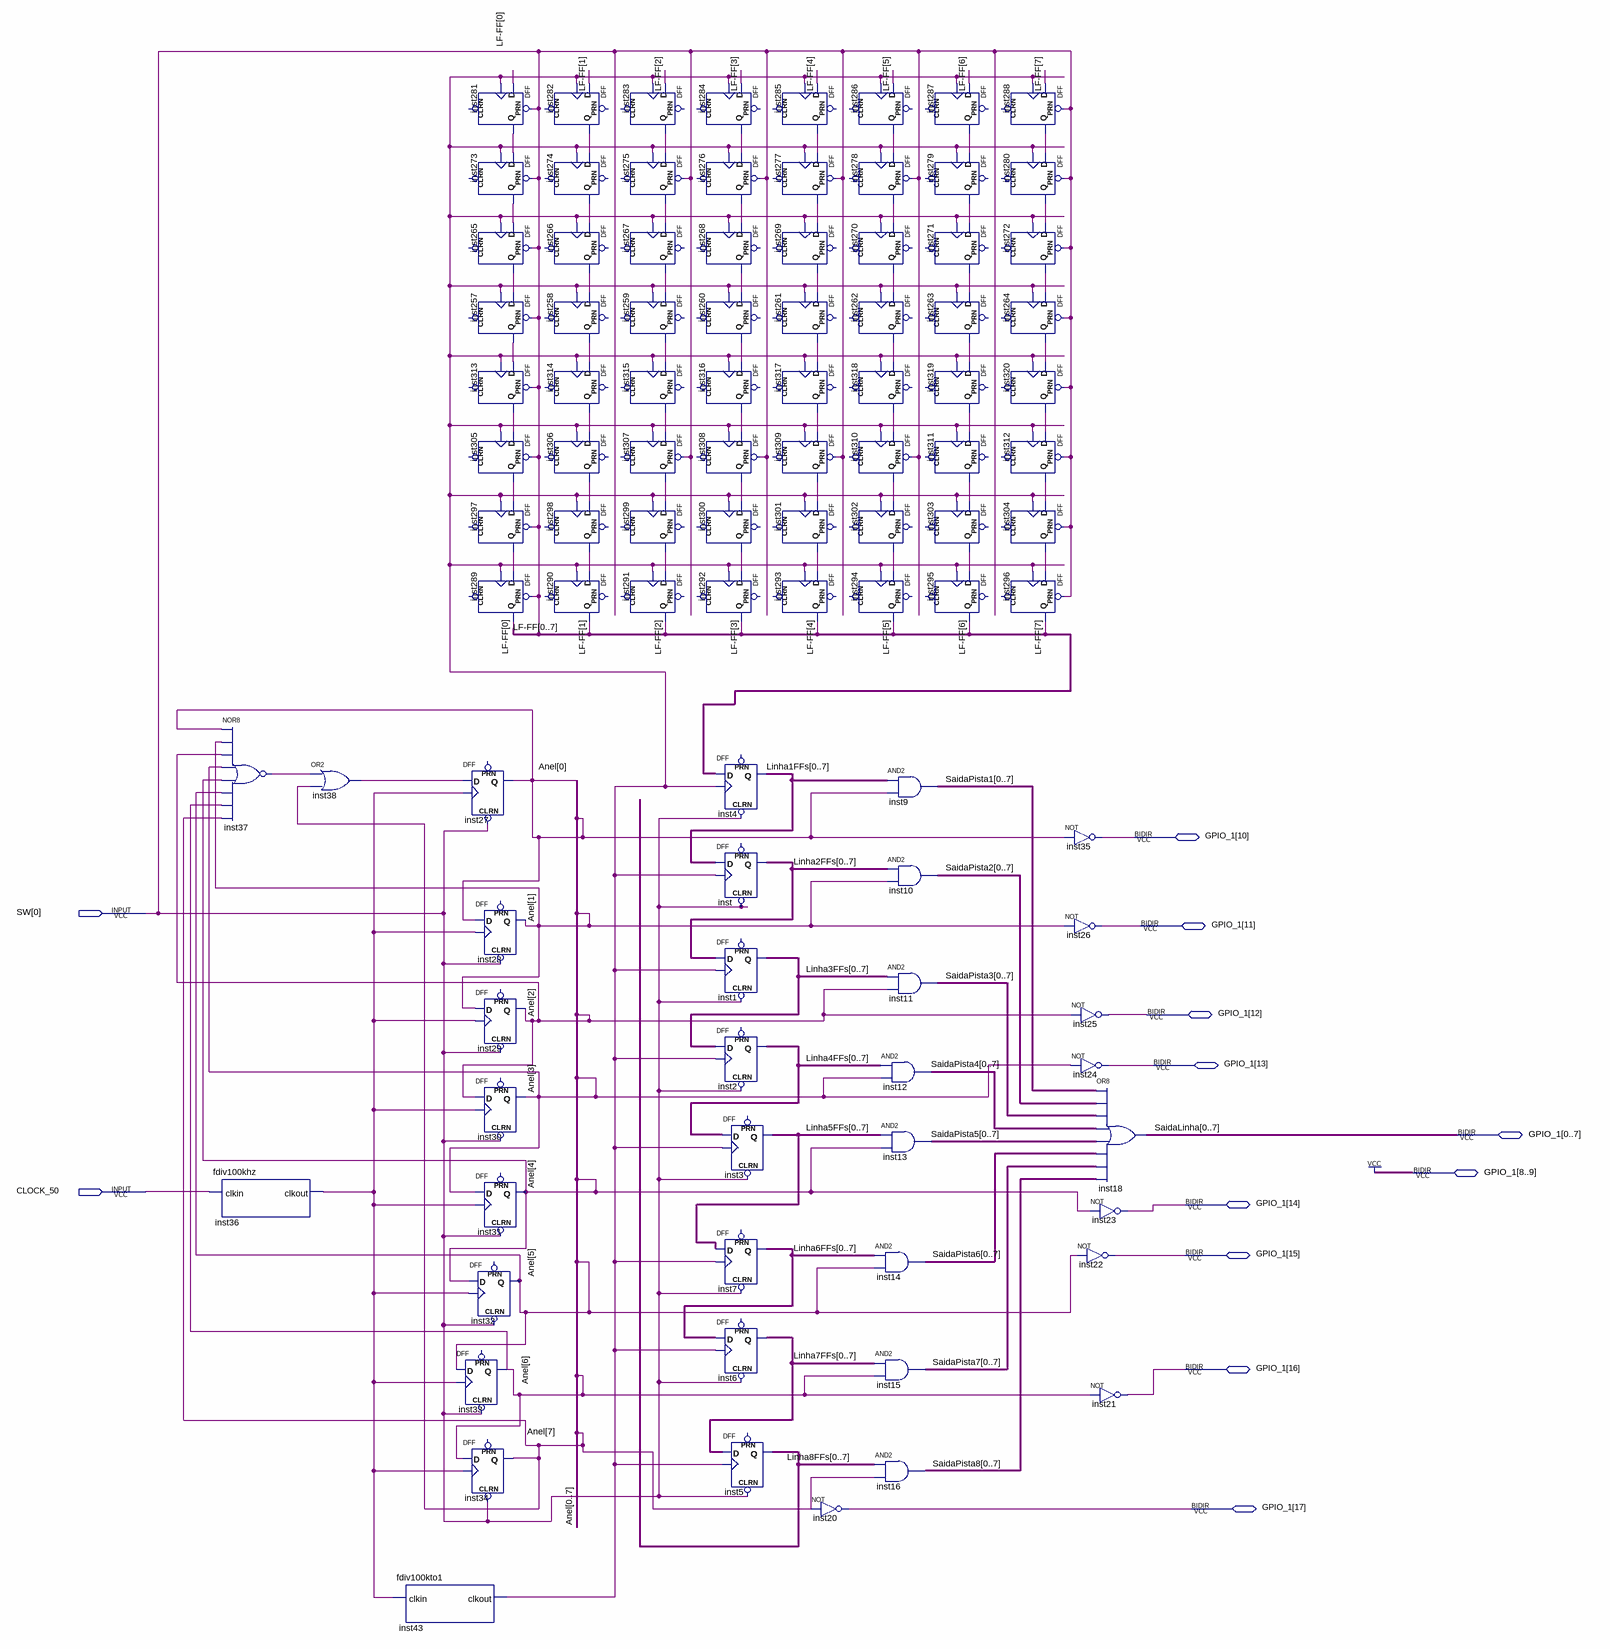
[diagram p0: schematic sheet]
// Quartus schematic TESTE_MAROTO.bdf as structural Verilog: 101 symbols, 12 pins
module TESTE_MAROTO (
  input  [0:0] SW,
  input  CLOCK_50,
  inout  [0:17] GPIO_1
);

  wire inst36_clkout, inst37_out, inst38_out, inst43_clkout, inst257_q, inst258_q, inst259_q, inst260_q,
       inst261_q, inst262_q, inst263_q, inst264_q, inst265_q, inst266_q, inst267_q, inst268_q, inst269_q,
       inst270_q, inst271_q, inst272_q, inst273_q, inst274_q, inst275_q, inst276_q, inst277_q, inst278_q,
       inst279_q, inst280_q, inst281_q, inst282_q, inst283_q, inst284_q, inst285_q, inst286_q, inst287_q,
       inst288_q, inst297_q, inst298_q, inst299_q, inst300_q, inst301_q, inst302_q, inst303_q, inst304_q,
       inst305_q, inst306_q, inst307_q, inst308_q, inst309_q, inst310_q, inst311_q, inst312_q, inst313_q,
       inst314_q, inst315_q, inst316_q, inst317_q, inst318_q, inst319_q, inst320_q;
  wire [7:0] Anel, \LF-FF , Linha1FFs, Linha2FFs, Linha3FFs, Linha4FFs, Linha5FFs, Linha6FFs, Linha7FFs,
       Linha8FFs, SaidaPista1, SaidaPista2, SaidaPista3, SaidaPista4, SaidaPista5, SaidaPista6, SaidaPista7,
       SaidaPista8;

  fdiv100khz inst36 (.clkin(CLOCK_50), .clkout(inst36_clkout));
  nor inst37 (inst37_out, Anel[0], Anel[1], Anel[2], Anel[3], Anel[4], Anel[5], Anel[6], Anel[7]);
  or inst38 (inst38_out, inst37_out, Anel[7]);
  fdiv100kto1 inst43 (.clkin(inst36_clkout), .clkout(inst43_clkout));
  DFF inst27 (.CLRN(SW[0]), .CLK(inst36_clkout), .D(inst38_out), .Q(Anel[0]));  // open: PRN
  DFF inst33 (.CLRN(SW[0]), .CLK(inst36_clkout), .D(Anel[5]), .Q(Anel[6]));  // open: PRN
  DFF inst34 (.CLRN(SW[0]), .CLK(inst36_clkout), .D(Anel[6]), .Q(Anel[7]));  // open: PRN
  DFF inst281 (.CLK(inst43_clkout), .D(\LF-FF [0]), .PRN(SW[0]), .Q(inst281_q));  // open: CLRN
  DFF inst273 (.CLK(inst43_clkout), .D(inst281_q), .PRN(SW[0]), .Q(inst273_q));  // open: CLRN
  DFF inst265 (.CLK(inst43_clkout), .D(inst273_q), .PRN(SW[0]), .Q(inst265_q));  // open: CLRN
  DFF inst257 (.CLK(inst43_clkout), .D(inst265_q), .PRN(SW[0]), .Q(inst257_q));  // open: CLRN
  DFF inst313 (.CLK(inst43_clkout), .D(inst257_q), .PRN(SW[0]), .Q(inst313_q));  // open: CLRN
  DFF inst305 (.CLK(inst43_clkout), .D(inst313_q), .PRN(SW[0]), .Q(inst305_q));  // open: CLRN
  DFF inst297 (.CLK(inst43_clkout), .D(inst305_q), .PRN(SW[0]), .Q(inst297_q));  // open: CLRN
  DFF inst289 (.CLK(inst43_clkout), .D(inst297_q), .PRN(SW[0]), .Q(\LF-FF [0]));  // open: CLRN
  DFF inst28 (.CLRN(SW[0]), .CLK(inst36_clkout), .D(Anel[0]), .Q(Anel[1]));  // open: PRN
  DFF inst29 (.CLRN(SW[0]), .CLK(inst36_clkout), .D(Anel[1]), .Q(Anel[2]));  // open: PRN
  DFF inst30 (.CLRN(SW[0]), .CLK(inst36_clkout), .D(Anel[2]), .Q(Anel[3]));  // open: PRN
  DFF inst31 (.CLRN(SW[0]), .CLK(inst36_clkout), .D(Anel[3]), .Q(Anel[4]));  // open: PRN
  DFF inst32 (.CLRN(SW[0]), .CLK(inst36_clkout), .D(Anel[4]), .Q(Anel[5]));  // open: PRN
  DFF inst282 (.CLK(inst43_clkout), .D(\LF-FF [1]), .Q(inst282_q));  // open: CLRN, PRN
  DFF inst274 (.CLK(inst43_clkout), .D(inst282_q), .Q(inst274_q));  // open: CLRN, PRN
  DFF inst266 (.CLK(inst43_clkout), .D(inst274_q), .Q(inst266_q));  // open: CLRN, PRN
  DFF inst258 (.CLK(inst43_clkout), .D(inst266_q), .Q(inst258_q));  // open: CLRN, PRN
  DFF inst314 (.CLK(inst43_clkout), .D(inst258_q), .Q(inst314_q));  // open: CLRN, PRN
  DFF inst306 (.CLK(inst43_clkout), .D(inst314_q), .Q(inst306_q));  // open: CLRN, PRN
  DFF inst298 (.CLK(inst43_clkout), .D(inst306_q), .Q(inst298_q));  // open: CLRN, PRN
  DFF inst290 (.CLK(inst43_clkout), .D(inst298_q), .Q(\LF-FF [1]));  // open: CLRN, PRN
  DFF inst283 (.CLK(inst43_clkout), .D(\LF-FF [2]), .Q(inst283_q));  // open: CLRN, PRN
  DFF inst275 (.CLK(inst43_clkout), .D(inst283_q), .PRN(SW[0]), .Q(inst275_q));  // open: CLRN
  DFF inst267 (.CLK(inst43_clkout), .D(inst275_q), .Q(inst267_q));  // open: CLRN, PRN
  DFF inst259 (.CLK(inst43_clkout), .D(inst267_q), .Q(inst259_q));  // open: CLRN, PRN
  DFF inst315 (.CLK(inst43_clkout), .D(inst259_q), .Q(inst315_q));  // open: CLRN, PRN
  DFF inst307 (.CLK(inst43_clkout), .D(inst315_q), .PRN(SW[0]), .Q(inst307_q));  // open: CLRN
  DFF inst299 (.CLK(inst43_clkout), .D(inst307_q), .Q(inst299_q));  // open: CLRN, PRN
  DFF inst291 (.CLK(inst43_clkout), .D(inst299_q), .Q(\LF-FF [2]));  // open: CLRN, PRN
  DFF inst284 (.CLK(inst43_clkout), .D(\LF-FF [3]), .Q(inst284_q));  // open: CLRN, PRN
  DFF inst276 (.CLK(inst43_clkout), .D(inst284_q), .PRN(SW[0]), .Q(inst276_q));  // open: CLRN
  DFF inst268 (.CLK(inst43_clkout), .D(inst276_q), .Q(inst268_q));  // open: CLRN, PRN
  DFF inst260 (.CLK(inst43_clkout), .D(inst268_q), .Q(inst260_q));  // open: CLRN, PRN
  DFF inst316 (.CLK(inst43_clkout), .D(inst260_q), .Q(inst316_q));  // open: CLRN, PRN
  DFF inst308 (.CLK(inst43_clkout), .D(inst316_q), .PRN(SW[0]), .Q(inst308_q));  // open: CLRN
  DFF inst300 (.CLK(inst43_clkout), .D(inst308_q), .Q(inst300_q));  // open: CLRN, PRN
  DFF inst292 (.CLK(inst43_clkout), .D(inst300_q), .Q(\LF-FF [3]));  // open: CLRN, PRN
  DFF inst4[7:0] (
    .CLRN(SW[0]), .CLK(inst43_clkout),
    .D({\LF-FF [0], \LF-FF [1], \LF-FF [2], \LF-FF [3], \LF-FF [4], \LF-FF [5], \LF-FF [6], \LF-FF [7]}),
    .Q({Linha1FFs[0], Linha1FFs[1], Linha1FFs[2], Linha1FFs[3], Linha1FFs[4], Linha1FFs[5], Linha1FFs[6], Linha1FFs[7]}));  // open: PRN
  DFF inst[7:0] (
    .CLRN(SW[0]), .CLK(inst43_clkout),
    .D({Linha1FFs[0], Linha1FFs[1], Linha1FFs[2], Linha1FFs[3], Linha1FFs[4], Linha1FFs[5], Linha1FFs[6], Linha1FFs[7]}),
    .Q({Linha2FFs[0], Linha2FFs[1], Linha2FFs[2], Linha2FFs[3], Linha2FFs[4], Linha2FFs[5], Linha2FFs[6], Linha2FFs[7]}));  // open: PRN
  DFF inst1[7:0] (
    .CLRN(SW[0]), .CLK(inst43_clkout),
    .D({Linha2FFs[0], Linha2FFs[1], Linha2FFs[2], Linha2FFs[3], Linha2FFs[4], Linha2FFs[5], Linha2FFs[6], Linha2FFs[7]}),
    .Q({Linha3FFs[0], Linha3FFs[1], Linha3FFs[2], Linha3FFs[3], Linha3FFs[4], Linha3FFs[5], Linha3FFs[6], Linha3FFs[7]}));  // open: PRN
  DFF inst2[7:0] (
    .CLRN(SW[0]), .CLK(inst43_clkout),
    .D({Linha3FFs[0], Linha3FFs[1], Linha3FFs[2], Linha3FFs[3], Linha3FFs[4], Linha3FFs[5], Linha3FFs[6], Linha3FFs[7]}),
    .Q({Linha4FFs[0], Linha4FFs[1], Linha4FFs[2], Linha4FFs[3], Linha4FFs[4], Linha4FFs[5], Linha4FFs[6], Linha4FFs[7]}));  // open: PRN
  DFF inst7[7:0] (
    .CLRN(SW[0]), .CLK(inst43_clkout),
    .D({Linha5FFs[0], Linha5FFs[1], Linha5FFs[2], Linha5FFs[3], Linha5FFs[4], Linha5FFs[5], Linha5FFs[6], Linha5FFs[7]}),
    .Q({Linha6FFs[0], Linha6FFs[1], Linha6FFs[2], Linha6FFs[3], Linha6FFs[4], Linha6FFs[5], Linha6FFs[6], Linha6FFs[7]}));  // open: PRN
  DFF inst6[7:0] (
    .CLRN(SW[0]), .CLK(inst43_clkout),
    .D({Linha6FFs[0], Linha6FFs[1], Linha6FFs[2], Linha6FFs[3], Linha6FFs[4], Linha6FFs[5], Linha6FFs[6], Linha6FFs[7]}),
    .Q({Linha7FFs[0], Linha7FFs[1], Linha7FFs[2], Linha7FFs[3], Linha7FFs[4], Linha7FFs[5], Linha7FFs[6], Linha7FFs[7]}));  // open: PRN
  DFF inst3[7:0] (
    .CLRN(SW[0]), .CLK(inst43_clkout),
    .D({Linha4FFs[0], Linha4FFs[1], Linha4FFs[2], Linha4FFs[3], Linha4FFs[4], Linha4FFs[5], Linha4FFs[6], Linha4FFs[7]}),
    .Q({Linha5FFs[0], Linha5FFs[1], Linha5FFs[2], Linha5FFs[3], Linha5FFs[4], Linha5FFs[5], Linha5FFs[6], Linha5FFs[7]}));  // open: PRN
  DFF inst5[7:0] (
    .CLRN(SW[0]), .CLK(inst43_clkout),
    .D({Linha7FFs[0], Linha7FFs[1], Linha7FFs[2], Linha7FFs[3], Linha7FFs[4], Linha7FFs[5], Linha7FFs[6], Linha7FFs[7]}),
    .Q({Linha8FFs[0], Linha8FFs[1], Linha8FFs[2], Linha8FFs[3], Linha8FFs[4], Linha8FFs[5], Linha8FFs[6], Linha8FFs[7]}));  // open: PRN
  DFF inst285 (.CLK(inst43_clkout), .D(\LF-FF [4]), .Q(inst285_q));  // open: CLRN, PRN
  DFF inst277 (.CLK(inst43_clkout), .D(inst285_q), .PRN(SW[0]), .Q(inst277_q));  // open: CLRN
  DFF inst269 (.CLK(inst43_clkout), .D(inst277_q), .Q(inst269_q));  // open: CLRN, PRN
  DFF inst261 (.CLK(inst43_clkout), .D(inst269_q), .Q(inst261_q));  // open: CLRN, PRN
  DFF inst317 (.CLK(inst43_clkout), .D(inst261_q), .Q(inst317_q));  // open: CLRN, PRN
  DFF inst309 (.CLK(inst43_clkout), .D(inst317_q), .PRN(SW[0]), .Q(inst309_q));  // open: CLRN
  DFF inst301 (.CLK(inst43_clkout), .D(inst309_q), .Q(inst301_q));  // open: CLRN, PRN
  DFF inst293 (.CLK(inst43_clkout), .D(inst301_q), .Q(\LF-FF [4]));  // open: CLRN, PRN
  not inst20 (GPIO_1[17], Anel[7]);
  DFF inst286 (.CLK(inst43_clkout), .D(\LF-FF [5]), .Q(inst286_q));  // open: CLRN, PRN
  DFF inst278 (.CLK(inst43_clkout), .D(inst286_q), .PRN(SW[0]), .Q(inst278_q));  // open: CLRN
  DFF inst270 (.CLK(inst43_clkout), .D(inst278_q), .Q(inst270_q));  // open: CLRN, PRN
  DFF inst262 (.CLK(inst43_clkout), .D(inst270_q), .Q(inst262_q));  // open: CLRN, PRN
  DFF inst318 (.CLK(inst43_clkout), .D(inst262_q), .Q(inst318_q));  // open: CLRN, PRN
  DFF inst310 (.CLK(inst43_clkout), .D(inst318_q), .PRN(SW[0]), .Q(inst310_q));  // open: CLRN
  DFF inst302 (.CLK(inst43_clkout), .D(inst310_q), .Q(inst302_q));  // open: CLRN, PRN
  DFF inst294 (.CLK(inst43_clkout), .D(inst302_q), .Q(\LF-FF [5]));  // open: CLRN, PRN
  assign {SaidaPista1[0], SaidaPista1[1], SaidaPista1[2], SaidaPista1[3], SaidaPista1[4], SaidaPista1[5], SaidaPista1[6], SaidaPista1[7]} = {Linha1FFs[0], Linha1FFs[1], Linha1FFs[2], Linha1FFs[3], Linha1FFs[4], Linha1FFs[5], Linha1FFs[6], Linha1FFs[7]} & {8{Anel[0]}};  // AND2 inst9, 8 bits wide
  assign {SaidaPista2[0], SaidaPista2[1], SaidaPista2[2], SaidaPista2[3], SaidaPista2[4], SaidaPista2[5], SaidaPista2[6], SaidaPista2[7]} = {Linha2FFs[0], Linha2FFs[1], Linha2FFs[2], Linha2FFs[3], Linha2FFs[4], Linha2FFs[5], Linha2FFs[6], Linha2FFs[7]} & {8{Anel[1]}};  // AND2 inst10, 8 bits wide
  assign {SaidaPista3[0], SaidaPista3[1], SaidaPista3[2], SaidaPista3[3], SaidaPista3[4], SaidaPista3[5], SaidaPista3[6], SaidaPista3[7]} = {Linha3FFs[0], Linha3FFs[1], Linha3FFs[2], Linha3FFs[3], Linha3FFs[4], Linha3FFs[5], Linha3FFs[6], Linha3FFs[7]} & {8{Anel[2]}};  // AND2 inst11, 8 bits wide
  assign {SaidaPista4[0], SaidaPista4[1], SaidaPista4[2], SaidaPista4[3], SaidaPista4[4], SaidaPista4[5], SaidaPista4[6], SaidaPista4[7]} = {Linha4FFs[0], Linha4FFs[1], Linha4FFs[2], Linha4FFs[3], Linha4FFs[4], Linha4FFs[5], Linha4FFs[6], Linha4FFs[7]} & {8{Anel[3]}};  // AND2 inst12, 8 bits wide
  assign {SaidaPista5[0], SaidaPista5[1], SaidaPista5[2], SaidaPista5[3], SaidaPista5[4], SaidaPista5[5], SaidaPista5[6], SaidaPista5[7]} = {Linha5FFs[0], Linha5FFs[1], Linha5FFs[2], Linha5FFs[3], Linha5FFs[4], Linha5FFs[5], Linha5FFs[6], Linha5FFs[7]} & {8{Anel[4]}};  // AND2 inst13, 8 bits wide
  assign {SaidaPista6[0], SaidaPista6[1], SaidaPista6[2], SaidaPista6[3], SaidaPista6[4], SaidaPista6[5], SaidaPista6[6], SaidaPista6[7]} = {Linha6FFs[0], Linha6FFs[1], Linha6FFs[2], Linha6FFs[3], Linha6FFs[4], Linha6FFs[5], Linha6FFs[6], Linha6FFs[7]} & {8{Anel[5]}};  // AND2 inst14, 8 bits wide
  assign {SaidaPista7[0], SaidaPista7[1], SaidaPista7[2], SaidaPista7[3], SaidaPista7[4], SaidaPista7[5], SaidaPista7[6], SaidaPista7[7]} = {Linha7FFs[0], Linha7FFs[1], Linha7FFs[2], Linha7FFs[3], Linha7FFs[4], Linha7FFs[5], Linha7FFs[6], Linha7FFs[7]} & {8{Anel[6]}};  // AND2 inst15, 8 bits wide
  assign {SaidaPista8[0], SaidaPista8[1], SaidaPista8[2], SaidaPista8[3], SaidaPista8[4], SaidaPista8[5], SaidaPista8[6], SaidaPista8[7]} = {Linha8FFs[0], Linha8FFs[1], Linha8FFs[2], Linha8FFs[3], Linha8FFs[4], Linha8FFs[5], Linha8FFs[6], Linha8FFs[7]} & {8{Anel[7]}};  // AND2 inst16, 8 bits wide
  DFF inst287 (.CLK(inst43_clkout), .D(\LF-FF [6]), .Q(inst287_q));  // open: CLRN, PRN
  DFF inst279 (.CLK(inst43_clkout), .D(inst287_q), .Q(inst279_q));  // open: CLRN, PRN
  DFF inst271 (.CLK(inst43_clkout), .D(inst279_q), .Q(inst271_q));  // open: CLRN, PRN
  DFF inst263 (.CLK(inst43_clkout), .D(inst271_q), .Q(inst263_q));  // open: CLRN, PRN
  DFF inst319 (.CLK(inst43_clkout), .D(inst263_q), .Q(inst319_q));  // open: CLRN, PRN
  DFF inst311 (.CLK(inst43_clkout), .D(inst319_q), .Q(inst311_q));  // open: CLRN, PRN
  DFF inst303 (.CLK(inst43_clkout), .D(inst311_q), .Q(inst303_q));  // open: CLRN, PRN
  DFF inst295 (.CLK(inst43_clkout), .D(inst303_q), .Q(\LF-FF [6]));  // open: CLRN, PRN
  DFF inst288 (.CLK(inst43_clkout), .D(\LF-FF [7]), .PRN(SW[0]), .Q(inst288_q));  // open: CLRN
  DFF inst280 (.CLK(inst43_clkout), .D(inst288_q), .PRN(SW[0]), .Q(inst280_q));  // open: CLRN
  DFF inst272 (.CLK(inst43_clkout), .D(inst280_q), .PRN(SW[0]), .Q(inst272_q));  // open: CLRN
  DFF inst264 (.CLK(inst43_clkout), .D(inst272_q), .PRN(SW[0]), .Q(inst264_q));  // open: CLRN
  DFF inst320 (.CLK(inst43_clkout), .D(inst264_q), .PRN(SW[0]), .Q(inst320_q));  // open: CLRN
  DFF inst312 (.CLK(inst43_clkout), .D(inst320_q), .PRN(SW[0]), .Q(inst312_q));  // open: CLRN
  DFF inst304 (.CLK(inst43_clkout), .D(inst312_q), .PRN(SW[0]), .Q(inst304_q));  // open: CLRN
  DFF inst296 (.CLK(inst43_clkout), .D(inst304_q), .PRN(SW[0]), .Q(\LF-FF [7]));  // open: CLRN
  not inst35 (GPIO_1[10], Anel[0]);
  not inst26 (GPIO_1[11], Anel[1]);
  not inst25 (GPIO_1[12], Anel[2]);
  not inst24 (GPIO_1[13], Anel[3]);
  assign GPIO_1[0:7] = {SaidaPista1[0], SaidaPista1[1], SaidaPista1[2], SaidaPista1[3], SaidaPista1[4], SaidaPista1[5], SaidaPista1[6], SaidaPista1[7]} | {SaidaPista2[0], SaidaPista2[1], SaidaPista2[2], SaidaPista2[3], SaidaPista2[4], SaidaPista2[5], SaidaPista2[6], SaidaPista2[7]} | {SaidaPista3[0], SaidaPista3[1], SaidaPista3[2], SaidaPista3[3], SaidaPista3[4], SaidaPista3[5], SaidaPista3[6], SaidaPista3[7]} | {SaidaPista4[0], SaidaPista4[1], SaidaPista4[2], SaidaPista4[3], SaidaPista4[4], SaidaPista4[5], SaidaPista4[6], SaidaPista4[7]} | {SaidaPista5[0], SaidaPista5[1], SaidaPista5[2], SaidaPista5[3], SaidaPista5[4], SaidaPista5[5], SaidaPista5[6], SaidaPista5[7]} | {SaidaPista6[0], SaidaPista6[1], SaidaPista6[2], SaidaPista6[3], SaidaPista6[4], SaidaPista6[5], SaidaPista6[6], SaidaPista6[7]} | {SaidaPista7[0], SaidaPista7[1], SaidaPista7[2], SaidaPista7[3], SaidaPista7[4], SaidaPista7[5], SaidaPista7[6], SaidaPista7[7]} | {SaidaPista8[0], SaidaPista8[1], SaidaPista8[2], SaidaPista8[3], SaidaPista8[4], SaidaPista8[5], SaidaPista8[6], SaidaPista8[7]};  // OR8 inst18, 8 bits wide
  not inst23 (GPIO_1[14], Anel[4]);
  not inst22 (GPIO_1[15], Anel[5]);
  not inst21 (GPIO_1[16], Anel[6]);
  // also tied to VCC on the sheet: GPIO_1[8:9]

  // Other names for the same wires on the sheet: SaidaLinha[7:0] = {GPIO_1[7], GPIO_1[6], GPIO_1[5], GPIO_1[4], GPIO_1[3], GPIO_1[2], GPIO_1[1], GPIO_1[0]}
endmodule
